# EAGLE design meter_hook (EAGLE 6.5.0)

## Sheet 1 of 2
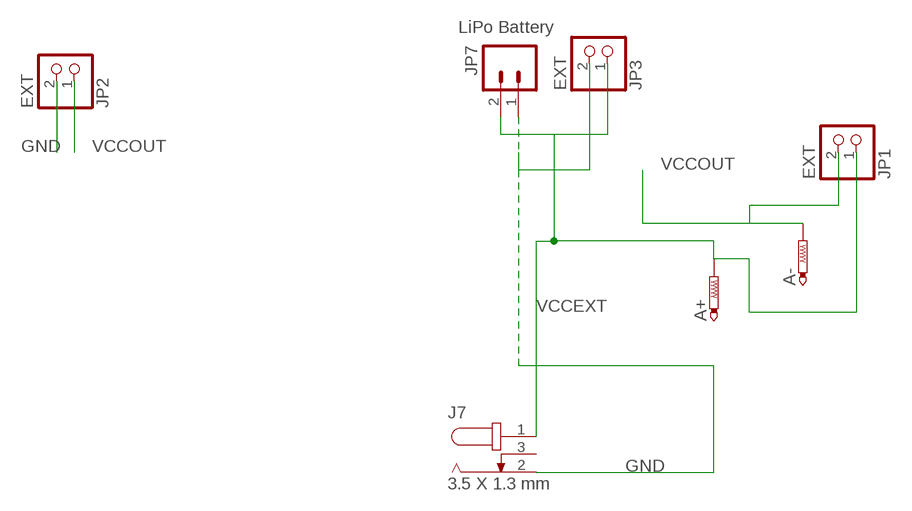
[diagram p0: schematic, sheet 1]

### Parts
A+  PTR1PAD1-13Y  [P1-13Y]
A-  PTR1PAD1-13Y  [P1-13Y]
J7  3.5 X 1.3 mm  DC_JACK_3.5X1.3MM  [3.5X1.3MM_DC_JACK]
JP1  EXT  PINHD-1X2  [1X02]
JP2  EXT  PINHD-1X2  [1X02]
JP3  EXT  PINHD-1X2  [1X02]
JP7  LiPo Battery  M02JST-PTH-2  [JST-2-PTH]

### Nets
GND [GND]: J7.2 JP2.2 JP3.2 JP7.1
VCCEXT [VCCEXT]: A+.TP J7.1 JP1.1 JP3.1 JP7.2
VCCOUT [VCC]: A-.TP JP1.2 JP2.1
Unconnected: J7.3

## Sheet 2 of 2

## Library data of the parts
A+ A- = testpad:PTR1: TEST PIN
J7 = MY_CONN:DC_JACK_3.5X1.3MM
JP1-JP3 = pinhead:PINHD-1X2: PIN HEADER
JP7 = SparkFun:M02: Header 2 Standard 2-pin 0.1" header. Use with straight break away headers (SKU : PRT-00116), right angle break away headers (PRT-00553), swiss pins (PRT-00743), machine pins (PRT-00117), and female headers (PRT-00115). Molex polarized connector foot print use with SKU : PRT-08233 with associated crimp pins and housings.

## Net classes
0 default: width 0.279 mm, drill 0.508 mm, clearance 0.229 mm
1 GND: width 0.61 mm, drill 0.508 mm, clearance 0.229 mm
2 VCC: width 0.61 mm, drill 0.508 mm, clearance 0.229 mm
3 AD: width 0.33 mm, drill 0.508 mm, clearance 0.229 mm
4 VCCEXT: width 0.762 mm, drill 0.508 mm, clearance 0.229 mm

## Board
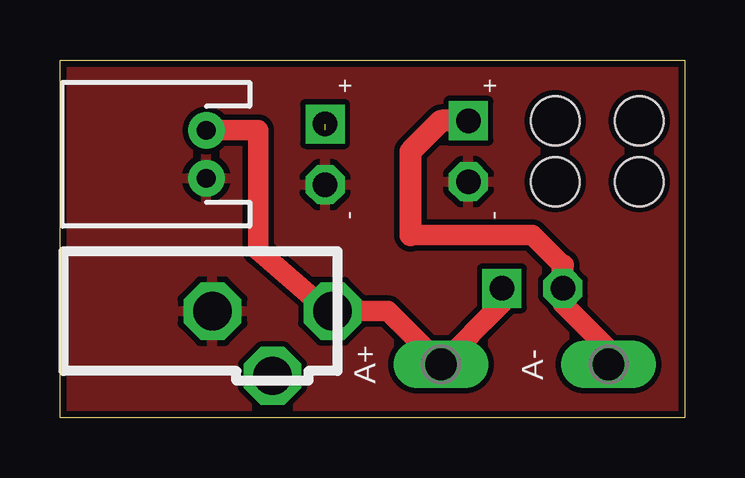
[diagram p1: board, top side]
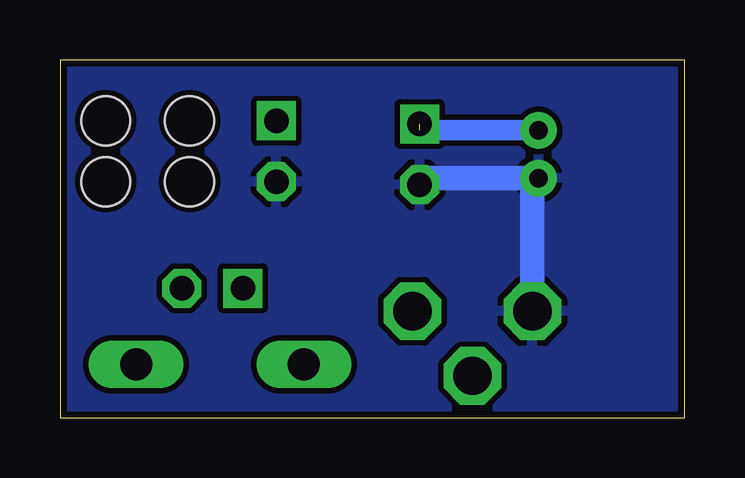
[diagram p2: board, bottom side, seen from below]

Size 26.04 x 14.92 mm. Coordinates in mm from the lower left corner, seen from the top.
Outline: 0,14.92 26.04,14.92 26.04,0 0,0 0,14.92
Copper layers (1*16): Top 0.035mm / dielectric 1.5mm / Bottom 0.035mm
Design rules "SparkFun *": minimum track width 10mil, minimum drill 20mil, track to track 8mil, track to pad 8mil, pad to pad 8mil, via to via 8mil, smd to smd 8mil, copper to edge 10mil, drill to drill 8mil, minimum pad ring 12mil, minimum via ring 10mil, stop-mask expansion 4mil, vias tented up to drill 25mil, thermal gap 10mil
Holes 2.03 mm at 20.64,9.84 20.64,12.38 24.13,9.84 24.13,12.38

### Footprints (pad centres in the part's own frame; a part is rotated, then mirrored left to right if it is on the bottom)
P1-13Y = drill 1.321 pad 1.905 long: TP 0,0
3.5X1.3MM_DC_JACK = drill 1.6 octagon: 1 0,0; 2 -5,0; 3 -2.5,-2.7
1X02 = drill 1.016 square: 1 -1.27,0 | drill 1.016 octagon: 2 1.27,0
JST-2-PTH = drill 0.787 pad 1.524: 1 -1,0; 2 1,0

### Placement (x,y rotation side)
A+  15.88,2.22 90 top
A-  22.86,2.22 90 top
J7  11.35,4.45 0 top
JP1  19.68,5.4 0 top
JP2  17.02,11.11 270 top
JP3  11.05,10.99 270 top
JP7  6.1,10.99 90 top

### Tracks (layer width: path | path; a pad name or v marks a point on that pad's centre or on a via)
GND
  Bottom 1.016: 11.05,9.99 JP7.1 6.35,9.99 J7.2
  pour Top: -1.14,17.84 26.92,17.84 26.92,-0.57 -1.14,-0.57
  pour Bottom: -1.14,17.84 26.92,17.84 26.92,-0.57 -1.14,-0.57
VCCEXT  (1 unrouted)
  Top 0.864: JP7.2 8.26,11.99 8.26,6.99 10.79,4.76 | J7.1 13.65,4.45 A+.TP 18.41,4.76 JP1.1
  Top 0.914: 10.79,4.76 J7.1
  Bottom 0.864: JP7.2 11.05,11.99
VCCOUT
  Top 0.864: JP1.2 20.95,4.76 22.86,2.86 A-.TP | 20.95,6.35 19.68,7.62 14.61,7.62
  Top 0.914: JP2.1 15.88,12.38 14.61,11.11 14.61,7.62 | JP1.2 20.95,6.35

### Text on the board
tNames: + | + | - | -